# EAGLE design grids_v02 (EAGLE 7.7.0)
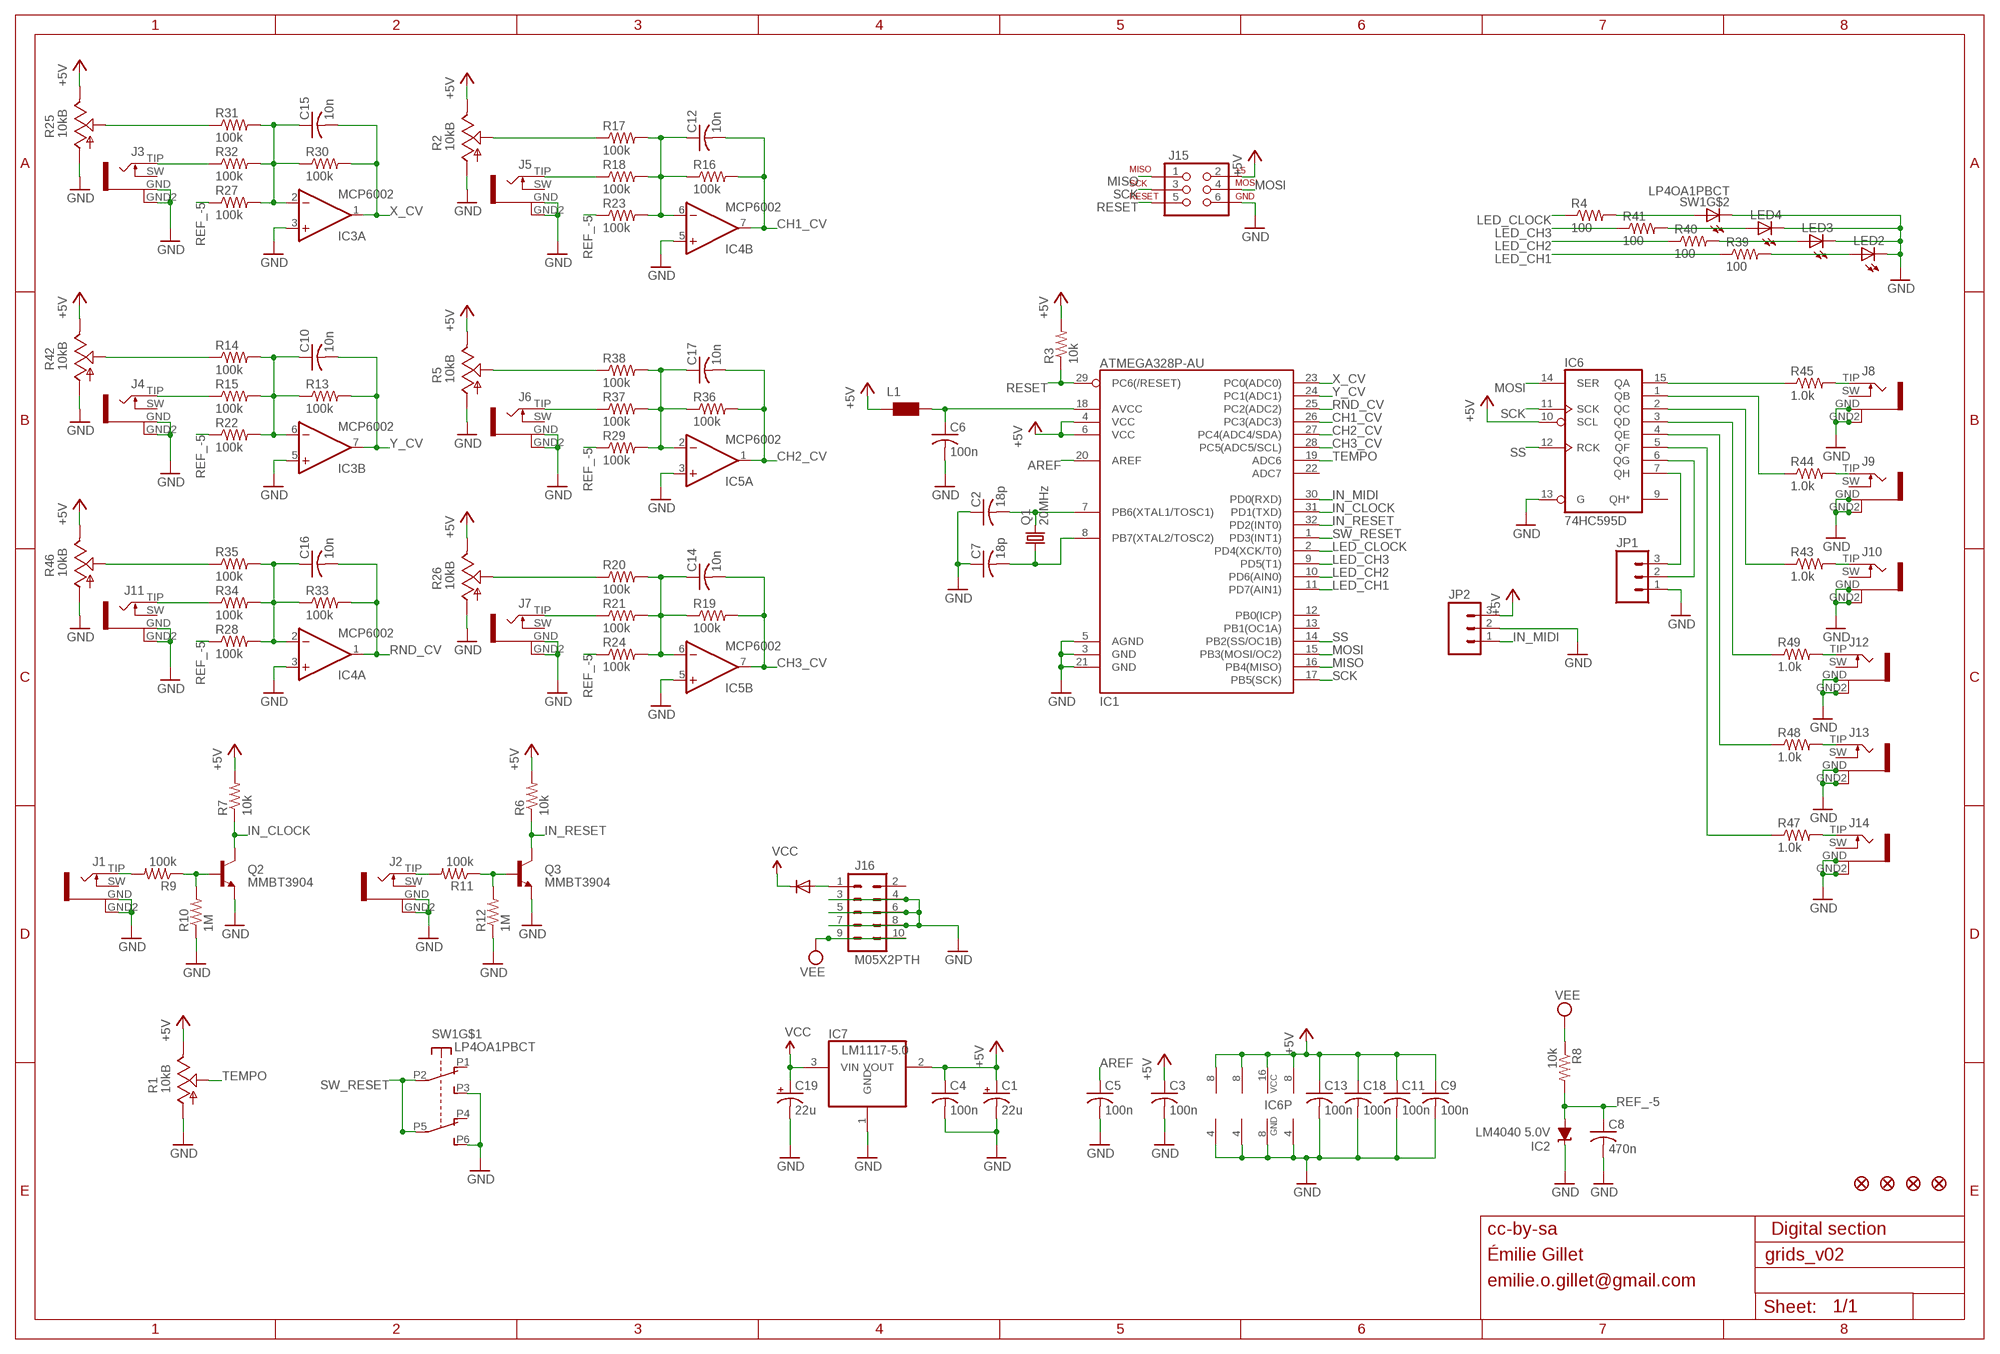
[diagram p0: schematic, sheet 1]

## Parts
C1  22u  CPOL-USC  [PANASONIC_C]
C2  18p  C-USC0603  [C0603]
C3  100n  C-USC0603  [C0603]
C4  100n  C-USC0603  [C0603]
C5  100n  C-USC0603  [C0603]
C6  100n  C-USC0603  [C0603]
C7  18p  C-USC0603  [C0603]
C8  470n  C-USC0603  [C0603]
C9  100n  C-USC0603  [C0603]
C10  10n  C-USC0603  [C0603]
C11  100n  C-USC0603  [C0603]
C12  10n  C-USC0603  [C0603]
C13  100n  C-USC0603  [C0603]
C14  10n  C-USC0603  [C0603]
C15  10n  C-USC0603  [C0603]
C16  10n  C-USC0603  [C0603]
C17  10n  C-USC0603  [C0603]
C18  100n  C-USC0603  [C0603]
C19  22u  CPOL-USC  [PANASONIC_C]
D1  1N5819HW  DIODE-SOD123  [SOD123]
F1  FIDUCIAL1X2  [FIDUCIAL-1X2]
F2  FIDUCIAL1X2  [FIDUCIAL-1X2]
F3  FIDUCIAL1X2  [FIDUCIAL-1X2]
F4  FIDUCIAL1X2  [FIDUCIAL-1X2]
IC1  ATMEGA328P-AU  ATMEGA168  [TQFP32-08]
IC2  LM4040 5.0V  LM4041C12DBZ  [DBZ_R-PDSO-G3]
IC3  MCP6002  TL072D  [SO08]
IC4  MCP6002  TL072D  [SO08]
IC5  MCP6002  TL072D  [SO08]
IC6  74HC595D  [SO16]
IC7  LM1117-5.0  REG1117  [SOT223]
J1  PJ301WQP  [WQP_PJ_301BM]
J2  PJ301WQP  [WQP_PJ_301BM]
J3  PJ301WQP  [WQP_PJ_301BM]
J4  PJ301WQP  [WQP_PJ_301BM]
J5  PJ301WQP  [WQP_PJ_301BM]
J6  PJ301WQP  [WQP_PJ_301BM]
J7  PJ301WQP  [WQP_PJ_301BM]
J8  PJ301WQP  [WQP_PJ_301BM]
J9  PJ301WQP  [WQP_PJ_301BM]
J10  PJ301WQP  [WQP_PJ_301BM]
J11  PJ301WQP  [WQP_PJ_301BM]
J12  PJ301WQP  [WQP_PJ_301BM]
J13  PJ301WQP  [WQP_PJ_301BM]
J14  PJ301WQP  [WQP_PJ_301BM]
J15  AVR_SPI_PRG_6PTH  [2X3]
J16  M05X2PTH  [AVR_ICSP]
JP1  M03PTH  [1X03]
JP2  M03PTH  [1X03]
L1  WE-CBF_0603  [0603]
LED2  LED3MM  [LED3MM]
LED3  LED3MM  [LED3MM]
LED4  LED3MM  [LED3MM]
Q1  20MHz  CRYSTALHC49UP  [HC49UP]
Q2  MMBT3904  MMBT3904LT1-NPN-SOT23-BEC  [SOT23-BEC]
Q3  MMBT3904  MMBT3904LT1-NPN-SOT23-BEC  [SOT23-BEC]
R1  10kB  POT_USVERTICAL_PS  [ALPS_POT_VERTICAL_PS]
R2  10kB  POT_USVERTICAL_PS  [ALPS_POT_VERTICAL_PS]
R3  10k  R-US_R0603  [R0603]
R4  100  R-US_R0603  [R0603]
R5  10kB  POT_USVERTICAL_PS  [ALPS_POT_VERTICAL_PS]
R6  10k  R-US_R0603  [R0603]
R7  10k  R-US_R0603  [R0603]
R8  10k  R-US_R0603  [R0603]
R9  100k  R-US_R0603  [R0603]
R10  1M  R-US_R0603  [R0603]
R11  100k  R-US_R0603  [R0603]
R12  1M  R-US_R0603  [R0603]
R13  100k  R-US_R0603  [R0603]
R14  100k  R-US_R0603  [R0603]
R15  100k  R-US_R0603  [R0603]
R16  100k  R-US_R0603  [R0603]
R17  100k  R-US_R0603  [R0603]
R18  100k  R-US_R0603  [R0603]
R19  100k  R-US_R0603  [R0603]
R20  100k  R-US_R0603  [R0603]
R21  100k  R-US_R0603  [R0603]
R22  100k  R-US_R0603  [R0603]
R23  100k  R-US_R0603  [R0603]
R24  100k  R-US_R0603  [R0603]
R25  10kB  POT_USVERTICAL_PS  [ALPS_POT_VERTICAL_PS]
R26  10kB  POT_USVERTICAL_PS  [ALPS_POT_VERTICAL_PS]
R27  100k  R-US_R0603  [R0603]
R28  100k  R-US_R0603  [R0603]
R29  100k  R-US_R0603  [R0603]
R30  100k  R-US_R0603  [R0603]
R31  100k  R-US_R0603  [R0603]
R32  100k  R-US_R0603  [R0603]
R33  100k  R-US_R0603  [R0603]
R34  100k  R-US_R0603  [R0603]
R35  100k  R-US_R0603  [R0603]
R36  100k  R-US_R0603  [R0603]
R37  100k  R-US_R0603  [R0603]
R38  100k  R-US_R0603  [R0603]
R39  100  R-US_R0603  [R0603]
R40  100  R-US_R0603  [R0603]
R41  100  R-US_R0603  [R0603]
R42  10kB  POT_USVERTICAL_PS4  [ALPS_POT_VERTICAL_PS4]
R43  1.0k  R-US_R0603  [R0603]
R44  1.0k  R-US_R0603  [R0603]
R45  1.0k  R-US_R0603  [R0603]
R46  10kB  POT_USVERTICAL_PS  [ALPS_POT_VERTICAL_PS]
R47  1.0k  R-US_R0603  [R0603]
R48  1.0k  R-US_R0603  [R0603]
R49  1.0k  R-US_R0603  [R0603]
SW1  LP4OA1PBCT  [LP4OA1PBCT]

## Nets
+5V: C1.+ C3.1 C4.1 C9.1 C11.1 C13.1 C18.1 IC1.4(VCC) IC1.6(VCC) IC3.8(P:V+) IC4.8(P:V+) IC5.8(P:V+) IC6.10(SCL) IC6.16(VCC) IC7.2(VOUT) J15.2 JP2.3 L1.1 R1.P$1(E) R2.P$1(E) R3.2 R5.P$1(E) R6.2 R7.2 R25.P$1(E) R26.P$1(E) R42.P$1(E) R46.P$1(E)
AREF: C5.1 IC1.20(AREF)
CH1_CV: C12.2 IC1.26(PC3(ADC3)) IC4.7(B:OUT) R16.2
CH2_CV: C17.2 IC1.27(PC4(ADC4/SDA)) IC5.1(A:OUT) R36.2
CH3_CV: C14.2 IC1.28(PC5(ADC5/SCL)) IC5.7(B:OUT) R19.2
CLOCK_OUT: IC6.6(QG) JP1.2
GATE1_IN: J1.TIP R9.2
GATE1_LED: R4.2 SW1.L1
GATE2_IN: J2.TIP R11.2
GATE2_LED: LED4.A R41.2
GATE3_LED: LED3.A R40.2
GATE4_LED: LED2.A R39.2
GND: C1.- C2.1 C3.2 C4.2 C5.2 C6.2 C7.1 C8.2 C9.2 C11.2 C13.2 C18.2 C19.- IC1.3(GND) IC1.5(AGND) IC1.21(GND) IC2.1(C) IC3.3(A:+IN) IC3.4(P:V-) IC3.5(B:+IN) IC4.3(A:+IN) IC4.4(P:V-) IC4.5(B:+IN) IC5.3(A:+IN) IC5.4(P:V-) IC5.5(B:+IN) IC6.8(GND) IC6.13(G) IC7.1(GND) J1.GND J1.GND2 J2.GND J2.GND2 J3.GND J3.GND2 J4.GND J4.GND2 J5.GND J5.GND2 J6.GND J6.GND2 J7.GND J7.GND2 J8.GND J8.GND2 J9.GND J9.GND2 J10.GND J10.GND2 J11.GND J11.GND2 J12.GND J12.GND2 J13.GND J13.GND2 J14.GND J14.GND2 J15.6 J16.3 J16.4 J16.5 J16.6 J16.7 J16.8 JP1.1 JP2.2 LED2.K(C) LED3.K(C) LED4.K(C) Q2.E Q3.E R1.P$3(A) R2.P$3(A) R5.P$3(A) R10.1 R12.1 R25.P$3(A) R26.P$3(A) R42.P$3(A) R46.P$3(A) SW1.L2 SW1.P3(A3) SW1.P6(B3)
IN_CLOCK: IC1.31(PD1(TXD)) Q2.C R7.1
IN_MIDI: IC1.30(PD0(RXD)) JP2.1
IN_RESET: IC1.32(PD2(INT0)) Q3.C R6.1
LED_CH1: IC1.11(PD7(AIN1)) R39.1
LED_CH2: IC1.10(PD6(AIN0)) R40.1
LED_CH3: IC1.9(PD5(T1)) R41.1
LED_CLOCK: IC1.2(PD4(XCK/T0)) R4.1
MISO: IC1.16(PB4(MISO)) J15.1
MOSI: IC1.15(PB3(MOSI/OC2)) IC6.14(SER) J15.4
N$1: Q2.B R9.1 R10.2
N$2: Q3.B R11.1 R12.2
N$3: D1.A J16.1
N$4: J14.TIP R47.2
N$5: J13.TIP R48.2
N$6: J12.TIP R49.2
N$9: R25.P$2(S) R31.1
N$10: J3.TIP R32.1
N$12: C10.1 IC3.6(B:-IN) R13.1 R14.2 R15.2 R22.2
N$13: R14.1 R42.P$2(S)
N$14: J4.TIP R15.1
N$15: C16.1 IC4.2(A:-IN) R28.2 R33.1 R34.2 R35.2
N$16: R35.1 R46.P$2(S)
N$17: J11.TIP R34.1
N$18: C12.1 IC4.6(B:-IN) R16.1 R17.2 R18.2 R23.2
N$19: R2.P$2(S) R17.1
N$20: J5.TIP R18.1
N$21: C17.1 IC5.2(A:-IN) R29.2 R36.1 R37.2 R38.2
N$22: R5.P$2(S) R38.1
N$23: J6.TIP R37.1
N$24: C14.1 IC5.6(B:-IN) R19.1 R20.2 R21.2 R24.2
N$25: R20.1 R26.P$2(S)
N$26: J7.TIP R21.1
N$27: IC6.15(QA) R45.1
N$28: IC6.1(QB) R44.1
N$29: C15.1 IC3.2(A:-IN) R27.2 R30.1 R31.2 R32.2
N$30: IC6.2(QC) R43.1
N$31: IC6.3(QD) R49.1
N$32: IC6.4(QE) R48.1
N$33: IC6.5(QF) R47.1
N$34: J8.TIP R45.2
N$35: J9.TIP R44.2
N$36: J10.TIP R43.2
N$39: C6.1 IC1.18(AVCC) L1.2
N$82: C7.2 IC1.8(PB7(XTAL2/TOSC2)) Q1.1
N$83: C2.2 IC1.7(PB6(XTAL1/TOSC1)) Q1.2
RANDOM_GATE: IC6.7(QH) JP1.3
REF_-5: C8.1 IC2.2(A) R8.2 R22.1 R23.1 R24.1 R27.1 R28.1 R29.1
RESET: IC1.29(PC6(/RESET)) J15.5 R3.1
RND_CV: C16.2 IC1.25(PC2(ADC2)) IC4.1(A:OUT) R33.2
SCK: IC1.17(PB5(SCK)) IC6.11(SCK) J15.3
SS: IC1.14(PB2(SS/OC1B)) IC6.12(RCK)
SW_RESET: IC1.1(PD3(INT1)) SW1.P2(A2) SW1.P5(B2)
TEMPO: IC1.19(ADC6) R1.P$2(S)
VCC: C19.+ D1.C IC7.3(VIN)
VEE: J16.9 J16.10 R8.1
X_CV: C15.2 IC1.23(PC0(ADC0)) IC3.1(A:OUT) R30.2
Y_CV: C10.2 IC1.24(PC1(ADC1)) IC3.7(B:OUT) R13.2
Unconnected: IC1.12(PB0(ICP)) IC1.13(PB1(OC1A)) IC1.22(ADC7) IC6.9(QH*) J1.SW J2.SW J3.SW J4.SW J5.SW J6.SW J7.SW J8.SW J9.SW J10.SW J11.SW J12.SW J13.SW J14.SW J16.2 SW1.P1(A1) SW1.P4(B1)

## Notes on the sheet
- cc-by-sa | Digital section
- Émilie Gillet
- emilie.o.gillet@gmail.com

## Library data of the parts
C1 C19 = rcl:CPOL-US: POLARIZED CAPACITOR, American symbol
C2-C18 = rcl:C-US: CAPACITOR, American symbol
D1 = diode:DIODE-: DIODE
F1-F4 = SparkFun:FIDUCIAL: Fiducial Alignment Points Various fiducial points for machine vision alignment.
IC1 = SparkFun:ATMEGA168
IC2 = texas:LM4041: PRECISION MICROPOWER SHUNT VOLTAGE REFERENCE Source: http://focus.ti.com/lit/ds/slcs146e/slcs146e.pdf
IC3-IC5 = og-linear:TL072: OP AMP
IC6 = 74xx-eu:74*595: 8-bit SHIFT REGISTER, output latch
IC7 = og-vreg:REG1117: 800mA and 1A Low Dropout (LDO) Positive Regulator 1.8V, 2.5V, 2.85V, 3.3V, 5V, and Adj
J1-J14 = og-pj301:PJ301
J15 = SparkFun:AVR_SPI_PRG_6: AVR ISP 6 Pin This is the reduced ISP connector for AVR programming. Common on Arduino. This footprint will take up less PCB space and can be used with a 10-pin to 6-pin adapter such as SKU: BOB-08508
J16 = og-header:M05X2: Header 5x2 Standard 10-pin dual row 0.1" header. Commonly used with AVR-ISP. Use with Spark Fun Electronics SKU: PRT-00778
JP1 JP2 = SparkFun:M03: Header 3 Standard 3-pin 0.1" header. Use with straight break away headers (SKU : PRT-00116), right angle break away headers (PRT-00553), swiss pins (PRT-00743), machine pins (PRT-00117), and female headers (PRT-00115). Molex polarized connector foot print use with SKU : PRT-08232 with associated crimp pins and housings.
L1 = wuerth-elektronik:WE-CBF: SMD EMI Suppression Ferrite Beads - excellent anti-EMI properties - low DCR - impedances till 3000 ohms - rated current up to 6 A
LED2-LED4 = led:LED: LED OSRAM: - CHIPLED LG R971, LG N971, LY N971, LG Q971, LY Q971, LO R971, LY R971 LH N974, LH R974 LS Q976, LO Q976, LY Q976 LO Q996 - Hyper CHIPLED LW Q18S LB Q993, LB Q99A, LB R99A - SideLED LS A670, LO A670, LY A670, LG A670, LP A670 LB A673, LV A673, LT A673, LW A673 LH A674 LY A675 LS A676, LA A676, LO A676, LY A676, LW A676 LS A679, LY A679, LG A679 - Hyper Micro SIDELED® LS Y876, LA Y876, LO Y876, LY Y876 LT Y87S - SmartLED LW L88C, LW L88S LB L89C, LB L89S, LG L890 LS L89K, LO L89K, LY L89K LS L896, LA L896, LO L896, LY L896 - TOPLED LS T670, LO T670, LY T670, LG T670, LP T670 LSG T670, LSP T670, LSY T670, LOP T670, LYG T670 LG T671, LOG T671, LSG T671 LB T673, LV T673, LT T673, LW T673 LH T674 LS T676, LA T676, LO T676, LY T676, LB T676, LH T676, LSB T676, LW T676 LB T67C, LV T67C, LT T67C, LS T67K, LO T67K, LY T67K, LW E67C LS E67B, LA E67B, LO E67B, LY E67B, LB E67C, LV E67C, LT E67C LW T67C LS T679, LY T679, LG T679 LS T770, LO T770, LY T770, LG T770, LP T770 LB T773, LV T773, LT T773, LW T773 LH T774 LS E675, LA E675, LY E675, LS T675 LS T776, LA T776, LO T776, LY T776, LB T776 LHGB T686 LT T68C, LB T68C - Hyper Mini TOPLED® LB M676 - Mini TOPLED Santana® LG M470 LS M47K, LO M47K, LY M47K Source: http://www.osram.convergy.de LUXEON: - LUMILED® LXK2-PW12-R00, LXK2-PW12-S00, LXK2-PW14-U00, LXK2-PW14-V00 LXK2-PM12-R00, LXK2-PM12-S00, LXK2-PM14-U00 LXK2-PE12-Q00, LXK2-PE12-R00, LXK2-PE12-S00, LXK2-PE14-T00, LXK2-PE14-U00 LXK2-PB12-K00, LXK2-PB12-L00, LXK2-PB12-M00, LXK2-PB14-N00, LXK2-PB14-P00, LXK2-PB14-Q00 LXK2-PR12-L00, LXK2-PR12-M00, LXK2-PR14-Q00, LXK2-PR14-R00 LXK2-PD12-Q00, LXK2-PD12-R00, LXK2-PD12-S00 LXK2-PH12-R00, LXK2-PH12-S00 LXK2-PL12-P00, LXK2-PL12-Q00, LXK2-PL12-R00 Source: www.luxeon.com KINGBRIGHT: KA-3528ASYC Source: www.kingbright.com
Q1 = crystal:CRYSTAL: CRYSTAL
Q2 Q3 = transistor:*-NPN-: NPN Transistror BF959 corrected 2008.03.06
R1 R2 R5 R25 R26 R42 R46 = pot-alps:POT_US
R3 R4 R6 R7 R9-R24 R27-R41 R43-R45 R47-R49 = rcl:R-US_: RESISTOR, American symbol
R8 = resistor:R-US_: RESISTOR, American symbol
SW1 = og-switch:LP4OA1PBCT

## Board
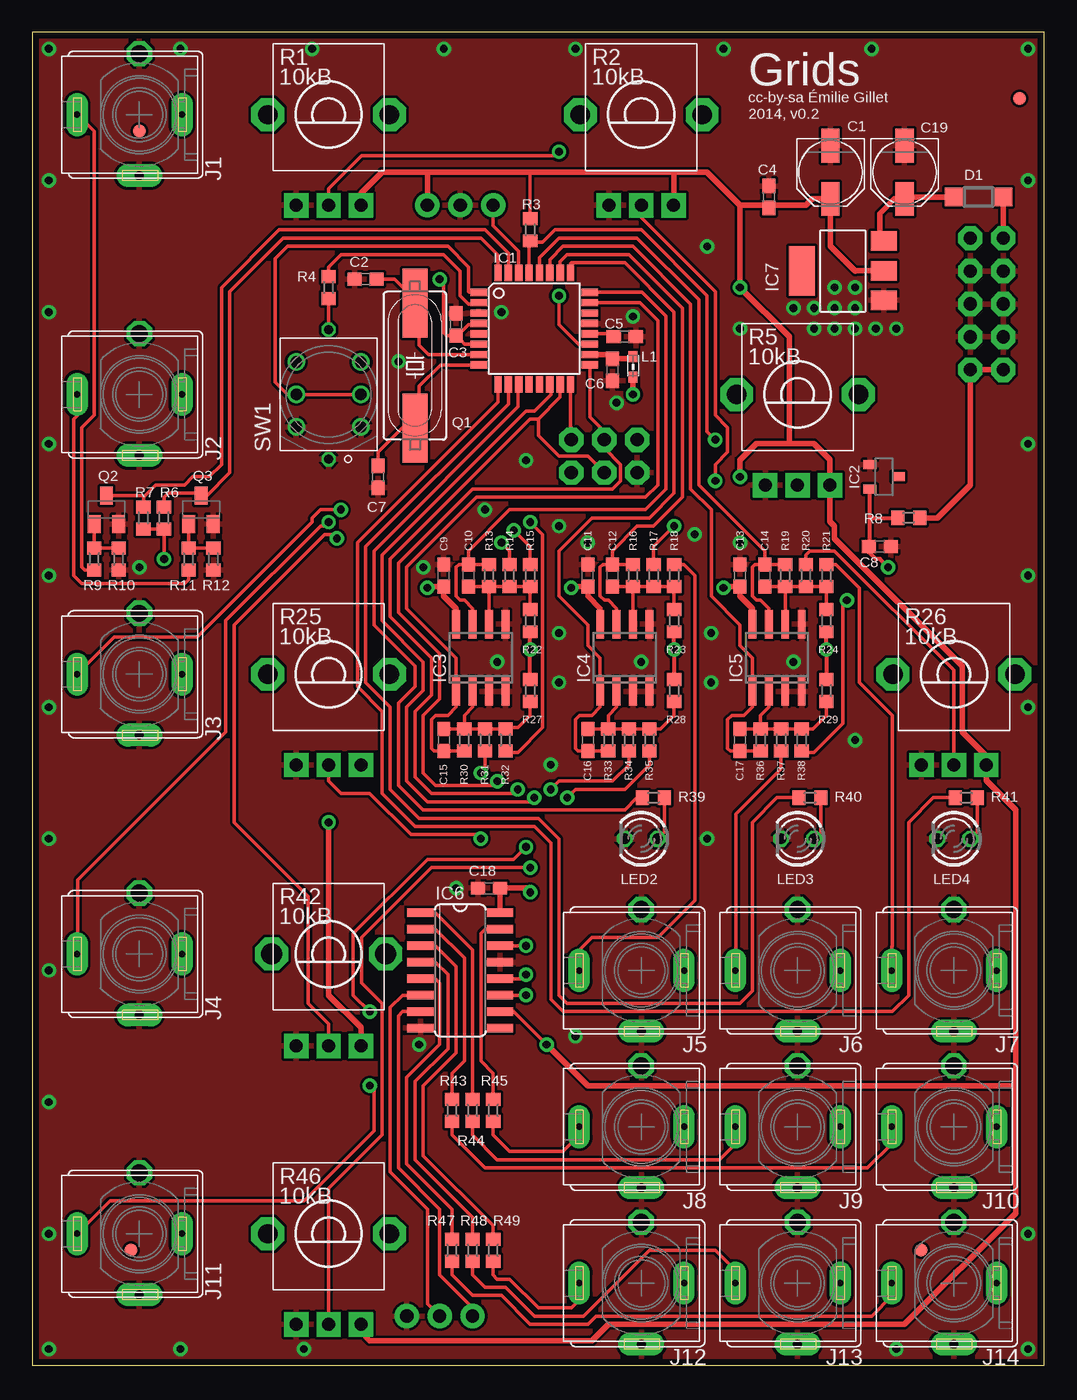
[diagram p1: board, top side]
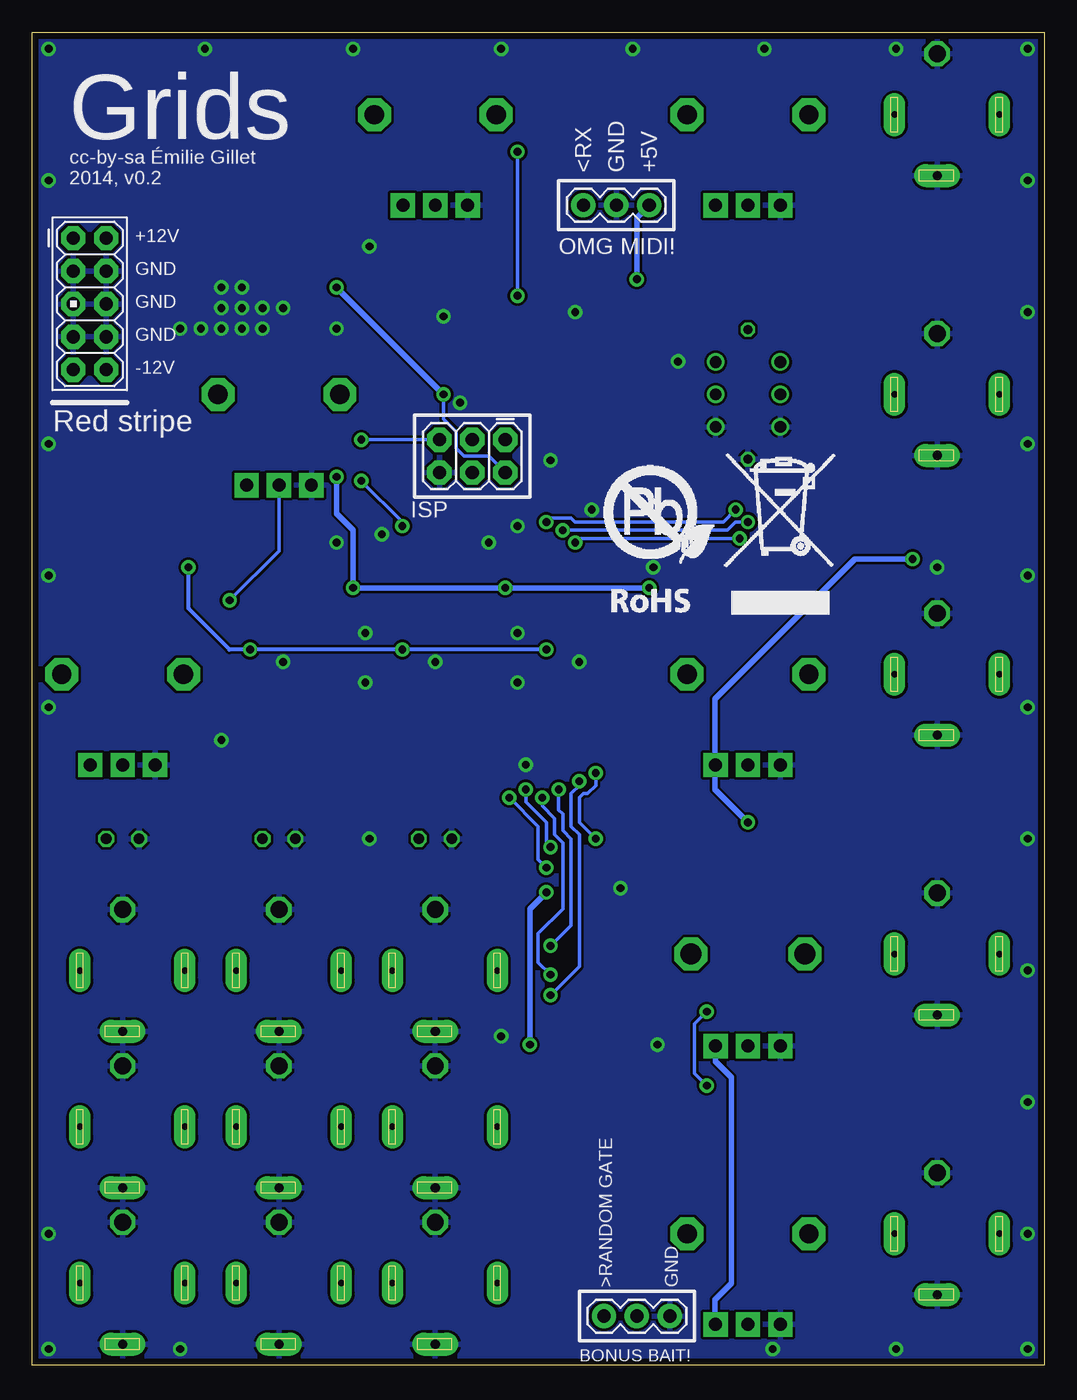
[diagram p2: board, bottom side, seen from below]

Size 78.08 x 102.87 mm. Coordinates in mm from the lower left corner, seen from the top.
Outline: 0,0 78.08,0 78.08,102.87 0,102.87 0,0
Copper layers (1*16): Top 0.035mm / dielectric 1.5mm / Bottom 0.035mm
Design rules "PCBCart-Standard *": minimum track width 8mil, minimum drill 0.4mm, track to track 8mil, track to pad 8mil, pad to pad 8mil, via to via 8mil, smd to smd 8mil, copper to edge 20mil, drill to drill 8mil, minimum pad ring 8mil, minimum via ring 10mil, stop-mask expansion 3mil, vias tented up to drill 25mil, thermal gap 8mil

### Footprints (pad centres in the part's own frame; a part is rotated, then mirrored left to right if it is on the bottom)
PANASONIC_C = smd 2.6 x 1.4: + 2.05,0; - -2.05,0
C0603 = smd 1.1 x 1: 1 -0.85,0; 2 0.85,0
SOD123 = smd 1.4 x 1.4: A 1.9,0; C -1.9,0
FIDUCIAL-1X2 = smd 1 x 1: 1 0,0
TQFP32-08 = smd 1.27 x 0.559: 1 -4.293,2.8; 2 -4.293,2; 3 -4.293,1.2; 4 -4.293,0.4; 5 -4.293,-0.4; 6 -4.293,-1.2; 7 -4.293,-2; 8 -4.293,-2.8; 17 4.293,-2.8; 18 4.293,-2; 19 4.293,-1.2; 20 4.293,-0.4; 21 4.293,0.4; 22 4.293,1.2; 23 4.293,2; 24 4.293,2.8 | smd 0.559 x 1.27: 9 -2.8,-4.293; 10 -2,-4.293; 11 -1.2,-4.293; 12 -0.4,-4.293; 13 0.4,-4.293; 14 1.2,-4.293; 15 2,-4.293; 16 2.8,-4.293; 25 2.8,4.293; 26 2,4.293; 27 1.2,4.293; 28 0.4,4.293; 29 -0.4,4.293; 30 -1.2,4.293; 31 -2,4.293; 32 -2.8,4.293
DBZ_R-PDSO-G3 = smd 0.7 x 1: 1 -0.95,-1.1; 2 0.95,-1.1; 3 0,1.1
SO08 = smd 0.6 x 2.2: 1 -1.905,-2.6; 2 -0.635,-2.6; 3 0.635,-2.6; 4 1.905,-2.6; 5 1.905,2.6; 6 0.635,2.6; 7 -0.635,2.6; 8 -1.905,2.6
SO16 = smd 0.66 x 2.032: 1 -4.445,-3.073; 2 -3.175,-3.073; 3 -1.905,-3.073; 4 -0.635,-3.073; 5 0.635,-3.073; 6 1.905,-3.073; 7 3.175,-3.073; 8 4.445,-3.073; 9 4.445,3.073; 10 3.175,3.073; 11 1.905,3.073; 12 0.635,3.073; 13 -0.635,3.073; 14 -1.905,3.073; 15 -3.175,3.073; 16 -4.445,3.073
SOT223 = smd 1.499 x 2.007: 1 -2.261,-3.15; 2 0.025,-3.15; 3 2.311,-3.15 | smd 3.81 x 2.007: 4 0,3.15
WQP_PJ_301BM = drill 0.7 pad 1.778 long: GND -4.7,0 | drill 1.3 octagon: GND2 4.7,0 | drill 0.5 pad 1.676 long: SW 0,-3.3; TIP 0,4.8
2X3 = drill 1.016 pad 1.88 octagon: 1 0,0; 2 0,2.54; 3 2.54,0; 4 2.54,2.54; 5 5.08,0; 6 5.08,2.54
AVR_ICSP = drill 1.016 pad 1.88 octagon: 1 -1.27,5.08; 2 1.27,5.08; 3 -1.27,2.54; 4 1.27,2.54; 5 -1.27,0; 6 1.27,0; 7 -1.27,-2.54; 8 1.27,-2.54; 9 -1.27,-5.08; 10 1.27,-5.08
1X03 = drill 1.016 pad 1.88 round: 1 0,0; 2 2.54,0; 3 5.08,0
0603 = smd 0.85 x 0.7: 1 -0.9,0; 2 0.7,0
LED3MM = drill 0.813 octagon: A -1.27,0; K 1.27,0
HC49UP = smd 5.334 x 1.93: 1 -4.826,0; 2 4.826,0
SOT23-BEC = smd 1 x 1.4: B -0.95,-1.1; C 0,1.1; E 0.95,-1.1
ALPS_POT_VERTICAL_PS = drill 1 pad 1.88 square: P$1 -2.5,7; P$2 0,7; P$3 2.5,7 | drill 1.5 pad 2.54 octagon: P$4 -4.7,0; P$5 4.7,0
R0603 = smd 1 x 1.1: 1 -0.85,0; 2 0.85,0
ALPS_POT_VERTICAL_PS4 = drill 1 pad 1.88 square: P$1 -2.5,7.1; P$2 0,7.1; P$3 2.5,7.1 | drill 1.6 pad 2.54 octagon: P$4 -4.4,0; P$5 4.4,0
LP4OA1PBCT = drill 0.7 octagon: L1 5,0; L2 -5,0 | drill 0.9 round: P1 2.5,2.5; P2 0,2.5; P3 -2.5,2.5; P4 2.5,-2.5; P5 0,-2.5; P6 -2.5,-2.5

### Placement (x,y rotation side)
C1  61.59,92.08 270 top
C2  25.72,83.82 0 top
C3  32.7,80.33 90 top
C4  56.83,90.17 90 top
C5  45.72,79.38 0 top
C6  44.77,76.83 270 top
C7  26.67,68.58 90 top
C8  65.41,63.18 0 top
C9  31.75,60.96 90 top
C10  33.66,60.96 90 top
C11  42.86,60.96 90 top
C12  44.77,60.96 90 top
C13  54.61,60.96 90 top
C14  56.52,60.96 90 top
C15  31.75,48.26 270 top
C16  42.86,48.26 270 top
C17  54.61,48.26 270 top
C18  35.24,36.83 180 top
C19  67.31,92.08 270 top
D1  73.03,90.17 0 top
F1  76.2,97.79 90 top
F2  8.26,95.25 90 top
F3  7.62,8.89 90 top
F4  68.58,8.89 90 top
IC1  38.73,80.01 0 top
IC2  65.72,68.58 270 top
IC3  34.61,54.61 0 top
IC4  45.72,54.61 0 top
IC5  57.47,54.61 0 top
IC6  33.02,30.48 270 top
IC7  62.55,84.45 90 top
J1  8.26,96.52 90 top
J2  8.26,74.93 90 top
J3  8.26,53.34 90 top
J4  8.26,31.75 90 top
J5  46.99,30.48 90 top
J6  59.05,30.48 90 top
J7  71.12,30.48 90 top
J8  46.99,18.41 90 top
J9  59.05,18.41 90 top
J10  71.12,18.41 90 top
J11  8.26,10.16 90 top
J12  46.99,6.35 90 top
J13  59.05,6.35 90 top
J14  71.12,6.35 90 top
J15  41.59,71.44 180 bottom
J16  73.66,81.92 0 bottom
JP1  28.89,3.81 180 bottom
JP2  35.56,89.53 0 bottom
L1  46.35,77.15 90 top
LED2  46.99,40.64 180 top
LED3  59.05,40.64 180 top
LED4  71.12,40.64 180 top
Q1  29.53,77.15 90 top
Q2  5.71,66.04 0 top
Q3  13.02,66.04 0 top
R1  22.86,96.52 180 top
R2  46.99,96.52 180 top
R3  38.42,87.63 90 top
R4  22.86,83.19 270 top
R5  59.05,74.93 180 top
R6  10.16,65.41 270 top
R7  8.57,65.41 270 top
R8  67.63,65.41 180 top
R9  4.76,62.23 270 top
R10  6.67,62.23 90 top
R11  12.06,62.23 270 top
R12  13.97,62.23 90 top
R13  35.24,60.96 90 top
R14  36.83,60.96 270 top
R15  38.42,60.96 270 top
R16  46.35,60.96 90 top
R17  47.94,60.96 270 top
R18  49.53,60.96 270 top
R19  58.1,60.96 90 top
R20  59.69,60.96 270 top
R21  61.28,60.96 270 top
R22  38.42,57.47 90 top
R23  49.53,57.47 90 top
R24  61.28,57.47 90 top
R25  22.86,53.34 180 top
R26  71.12,53.34 180 top
R27  38.42,52.07 270 top
R28  49.53,52.07 270 top
R29  61.28,52.07 270 top
R30  33.34,48.26 270 top
R31  34.92,48.26 90 top
R32  36.51,48.26 90 top
R33  44.45,48.26 270 top
R34  46.04,48.26 90 top
R35  47.62,48.26 90 top
R36  56.2,48.26 270 top
R37  57.78,48.26 90 top
R38  59.37,48.26 90 top
R39  47.94,43.81 0 top
R40  60.01,43.81 0 top
R41  72.07,43.81 0 top
R42  22.86,31.75 180 top
R43  32.38,19.68 270 top
R44  33.97,19.68 270 top
R45  35.56,19.68 270 top
R46  22.86,10.16 180 top
R47  32.38,8.89 270 top
R48  33.97,8.89 270 top
R49  35.56,8.89 270 top
SW1  22.86,74.93 90 top
U$1  [EURORACK_TEMPLATE]  -0.64,117.47 0 top  (outside the outline)
U$2  [ROHS_BIG]  35.24,57.15 0 bottom

### Tracks (layer width: path | path; a pad name or v marks a point on that pad's centre or on a via)
+5V  (via drill 0.6)
  Top 0.254: v39.69,24.77 37.15,27.3 IC6.10 | 38.42,92.08 R3.2 | 34.51,78.74 IC1.6 33.37,78.81 33.07,79.11 | v10.16,62.23 R6.2 R7.2 | v31.43,83.82 31.75,83.5 31.75,79.69 31.96,79.48 C3.1 33.07,79.11 | IC1.4 34.36,80.33 33.66,80.33 33.07,79.74 33.07,79.11
  Top 0.406: 30.48,92.08 26.99,92.08 25.36,90.45 R1.P$1 | 30.48,92.08 38.42,92.08 49.53,92.08 | v39.69,24.77 42.86,21.59 75.88,21.59 | IC3.8 32.66,57.25 32.7,57.3 32.7,58.42 31.75,59.37 C9.1 30.58,60.11 v30.48,60.01 | IC4.8 43.77,57.25 43.81,57.3 43.81,58.42 42.86,59.37 C11.1 41.7,60.11 v41.59,60.01 | v46.35,74.93 L1.1 | IC5.8 55.56,58.42 54.61,59.37 C13.1 | C13.1 54.51,60.01 | v38.42,36.51 38.1,36.83 C18.1 IC6.16 | v22.86,41.91 22.86,28.57 25.36,26.07 R42.P$1 | 75.88,21.59 75.88,42.86 73.62,45.12 R26.P$1 73.66,46.38 73.66,46.99 71.75,48.9 71.75,53.98 61.91,63.82 61.91,64.77 61.55,65.13 R5.P$1 61.55,69.89 60.33,71.12 58.42,71.12 | R46.P$1 25.36,2.58 26.04,1.91 43.18,1.91 44.45,3.17 67.31,3.17 75.88,11.75 75.88,21.59 | v53.34,60.01 53.44,60.11 C13.1 | v54.61,68.58 54.61,69.85 55.88,71.12 58.42,71.12 | 30.48,92.08 JP2.3 | R2.P$1 49.53,89.56 49.53,92.08 | 58.42,71.12 58.42,79.38 v54.61,83.19 54.61,89.53 | IC7.2 63.5,84.48 63.5,84.45 61.59,86.36 C1.+ 60.18,90.03 59.69,89.53 57.05,89.53 C4.1 56.62,89.53 54.61,89.53 | 49.53,92.08 52.07,92.08 54.61,89.53
  Bottom 0.254: J15.2 42.86,70.17 44.77,70.17 45.4,70.8 45.4,72.07 46.35,73.03 v46.35,74.93
  Bottom 0.406: v39.69,24.77 39.69,35.24 v38.42,36.51 | v30.48,60.01 v41.59,60.01 v53.34,60.01 53.34,64.45 54.61,65.72 v54.61,68.58 | v54.61,83.19 v46.35,74.93 | JP2.3 31.43,88.58 v31.43,83.82 | v22.86,41.91 25.4,44.45 25.4,46.3 R25.P$1 25.36,46.64 25.4,46.68 25.4,51.44 14.61,62.23 v10.16,62.23 | R46.P$1 25.4,3.2 25.4,5.08 24.13,6.35 24.13,22.23 25.36,23.45 R42.P$1
AREF
  Top 0.254: C5.1 44.63,79.61 IC1.20
CH1_CV
  Top 0.254: IC4.7 45.09,58.42 44.45,59.05 44.13,59.05 43.81,59.37 43.81,61.59 44.03,61.81 C12.2 | C12.2 R16.2 | C12.2 44.77,62.87 46.67,64.77 47.94,64.77 50.16,66.99 50.16,81.6 46.04,85.72 41.27,85.72 40.73,85.19 IC1.26
CH2_CV
  Top 0.254: IC1.27 39.94,85.34 40.96,86.36 46.35,86.36 50.8,81.92 50.8,67.63 52.39,66.04 52.39,59.37 54.61,57.15 54.61,55.56 55.56,54.61 IC5.1 55.56,50.8 54.93,50.16 53.98,50.16 53.66,49.85 53.66,47.62 53.87,47.41 C17.2 R36.2
CH3_CV
  Top 0.254: C14.2 56.52,62.87 51.44,67.94 51.44,82.23 46.67,87 40.64,87 39.13,85.49 IC1.28 | IC5.7 56.83,58.42 56.2,59.05 55.88,59.05 55.56,59.37 55.56,61.59 55.78,61.81 C14.2 | C14.2 R19.2
CLOCK_OUT
  Top 0.254: IC6.6 28.57,28.57 27.62,27.62 27.62,14.92 30.48,12.06 30.48,4.76 JP1.2
GATE1_IN
  Top 0.254: R9.2 4.03,61.38 3.81,61.59 3.81,72.39 4.76,73.34 4.76,95.25 3.49,96.52 J1.TIP
GATE1_LED
  Top 0.254: SW1.L1 R4.2
GATE2_IN
  Top 0.254: J2.TIP 3.49,74.89 3.49,73.34 3.17,73.03 3.17,60.96 3.81,60.33 11.75,60.33 12.06,60.64 R11.2
GATE2_LED
  Top 0.254: LED4.A 72.92,41.17 R41.2
GATE3_LED
  Top 0.254: LED3.A 60.86,41.17 R40.2
GATE4_LED
  Top 0.254: LED2.A 48.79,41.17 R39.2
GND  (via drill 0.6)
  other vias: 8.26,61.59 46.35,80.96 46.99,54.29 58.74,54.29 42.86,63.5 54.61,63.5 35.88,54.29 30.16,61.59 45.09,74.3 36.2,81.28 40.01,46.35 40.64,52.7 32.7,36.83 29.84,24.77 28.26,77.47 52.07,86.36 54.61,80.01 38.1,69.85 52.39,52.7 40.64,56.52 52.39,56.52 41.91,25.4 34.92,66.04 40.64,64.77 51.12,64.14 1.27,20.32 11.43,1.27 1.27,30.48 1.27,81.28 1.27,91.44 20.95,1.27 1.27,101.6 1.27,1.27 63.5,48.26 76.83,101.6 76.83,91.44 76.83,71.12 76.83,60.96 76.83,50.8 76.83,1.27 66.67,1.27 76.83,10.16 52.07,40.64 1.27,60.96 1.27,50.8 1.27,71.12 1.27,40.64 1.27,10.16 11.43,101.6 21.59,101.6 31.75,101.6 41.91,101.6 53.34,101.6 64.77,101.6 63.5,83.19 63.5,81.6 61.91,83.19 61.91,81.6 63.5,80.01 65.09,80.01 61.91,80.01 66.67,80.01 60.33,80.01 60.33,81.6 58.74,81.6
  pour Bottom: 0,102.87 0,0 78.11,0 78.11,102.87
  pour Top: 0,102.87 0,0 78.11,0 78.11,102.87
IN_CLOCK
  Top 0.254: 8.57,66.99 9.53,67.94 11.75,67.94 12.38,68.58 13.65,68.58 14.61,69.53 14.61,83.19 19.05,87.63 34.92,87.63 36.73,85.82 IC1.31 | 8.57,66.99 R7.1 | 8.57,66.99 8.43,67.14 Q2.C
IN_MIDI
  Top 0.254: JP2.1 35.56,87.95 37.53,85.97 IC1.30
IN_RESET
  Top 0.254: IC1.32 35.94,85.67 34.61,87 19.37,87 15.24,82.87 15.24,68.9 13.48,67.14 Q3.C 12.85,67.31 10.48,67.31 10.16,66.99 R6.1
LED_CH1
  Top 0.254: IC1.11 37.47,75.65 37.47,73.98 26.35,62.87 26.35,57.15 29.53,53.98 29.53,52.39 28.26,51.12 28.26,44.77 30.16,42.86 45.72,42.86 46.67,43.81 R39.1
LED_CH2
  Top 0.254: 36.83,75.62 IC1.10 36.73,74.2 25.72,63.18 25.72,52.7 27.62,50.8 27.62,44.45 29.84,42.23 39.05,42.23 40.64,40.64 40.64,28.57 41.27,27.94 54.61,27.94 55.56,28.89 55.56,41.91 57.47,43.81 R40.1
LED_CH3
  Top 0.254: 35.88,75.66 IC1.9 35.94,74.35 25.08,63.5 25.08,52.39 26.99,50.48 26.99,44.13 29.53,41.59 38.73,41.59 40.01,40.32 40.01,28.26 40.96,27.3 66.36,27.3 67.63,28.57 67.63,41.91 69.53,43.81 R41.1
LED_CLOCK
  Top 0.254: IC1.2 34.35,81.92 33.66,81.92 33.02,82.55 33.02,84.45 31.75,85.72 23.81,85.72 22.86,84.77 R4.1
MISO
  Top 0.254: J15.1 41.59,72.39 41.53,72.45 IC1.16
MOSI  (via drill 0.6)
  Top 0.254: J15.4 42.86,70.17 40.64,70.17 39.05,71.75 39.05,73.03 | v37.47,44.45 37.15,44.13 30.8,44.13 29.53,45.4 29.53,50.48 30.8,51.75 30.8,54.61 27.62,57.78 27.62,62.23 38.42,73.03 39.05,73.03 | IC6.14 v38.1,32.38 | 39.05,73.03 40.73,74.71 IC1.15
  Bottom 0.254: v37.47,44.45 37.47,42.86 37.15,42.55 37.15,41.27 36.51,40.64 36.51,33.97 v38.1,32.38
N$1
  Top 0.254: R10.2 R9.1 Q2.B
N$2
  Top 0.254: R12.2 R11.1 Q3.B
N$3
  Top 0.406: J16.1 D1.A
N$4
  Top 0.254: J14.TIP 66.32,5.36 64.77,3.81 43.5,3.81 42.86,3.17 38.42,3.17 36.2,5.4 33.97,5.4 32.38,6.99 R47.2
N$5
  Top 0.254: J13.TIP 54.26,7.34 52.7,8.89 47.62,8.89 42.55,3.81 38.73,3.81 36.51,6.03 34.92,6.03 33.97,6.99 R48.2
N$6
  Top 0.254: J12.TIP 42.19,5.04 41.59,4.45 39.05,4.45 36.83,6.67 35.88,6.67 35.56,6.99 R49.2
N$9  (via drill 0.6)
  Top 0.254: v34.61,40.64 34.29,40.96 29.21,40.96 26.04,44.13 23.81,44.13 22.86,45.09 R25.P$2 | v34.61,45.72 34.92,46.04 R31.1
  Bottom 0.254: v34.61,40.64 35.88,41.91 35.88,43.81 35.56,44.13 35.24,44.13 34.61,44.77 v34.61,45.72
N$10  (via drill 0.6)
  Top 0.254: J3.TIP 6.31,56.2 12.7,56.2 21.59,65.09 21.59,65.41 22.23,66.04 v23.81,66.04 | R32.1 36.62,47.31 37.47,47.31 39.37,49.21 39.37,64.14 v38.42,65.09
  Bottom 0.254: v38.42,65.09 38.1,65.41 36.51,65.41 36.2,65.09 24.77,65.09 v23.81,66.04
N$12
  Top 0.254: R13.1 C10.1 | IC3.6 R13.1 | R13.1 R14.2 R15.2 R22.2
N$13  (via drill 0.6)
  Top 0.254: R42.P$2 22.86,26.35 21.27,27.94 21.27,36.2 15.56,41.91 15.56,57.15 22.54,64.14 23.18,64.14 v23.5,63.82 | v36.2,63.5 36.83,62.87 R14.1
  Bottom 0.254: v23.5,63.82 35.88,63.82 v36.2,63.5
N$14  (via drill 0.6)
  Top 0.254: J4.TIP 3.49,31.79 3.49,37.47 14.92,48.9 14.92,57.47 22.23,64.77 22.54,64.77 v22.86,65.09 | v37.15,64.45 38.42,63.18 R15.1
  Bottom 0.254: v37.15,64.45 24.45,64.45 23.81,65.09 v22.86,65.09
N$15
  Top 0.254: C16.1 R33.1 | IC4.2 45.09,50.8 44.45,50.16 R33.1 | R33.1 R34.2 R35.2 48.48,49.11 49.53,50.16 R28.2
N$16  (via drill 0.6)
  Top 0.254: R35.1 47.62,46.35 45.72,44.45 41.91,44.45 v41.27,43.81 | R46.P$2 22.86,13.65 26.99,17.78 26.99,27.94 25.4,29.53 25.4,33.02 30.8,38.42 v38.42,38.42
  Bottom 0.254: v38.42,38.42 39.05,39.05 39.05,41.59 v41.27,43.81
N$17  (via drill 0.6)
  Top 0.254: R34.1 46.04,46.35 44.77,45.09 40.64,45.09 v40.01,44.45 | J11.TIP 6,12.7 20.95,12.7 26.35,18.1 26.35,21.27 v26.04,21.59 | v38.1,40.01 37.15,39.05 30.48,39.05 24.77,33.34 24.77,28.57 v26.04,27.3
  Bottom 0.254: v38.1,40.01 38.42,40.32 38.42,41.91 40.01,43.5 v40.01,44.45 | v26.04,27.3 26.99,26.35 26.99,22.54 v26.04,21.59
N$18
  Top 0.254: R16.1 IC4.6 | C12.1 R16.1 | R16.1 R17.2 R18.2 R23.2
N$19  (via drill 0.6)
  Top 0.254: R2.P$2 46.99,88.58 52.7,82.87 52.7,73.34 53.66,72.39 53.66,70.48 52.7,69.53 v52.7,68.26 | v49.53,64.77 47.94,63.18 R17.1
  Bottom 0.254: v49.53,64.77 49.53,65.09 v52.7,68.26
N$20
  Top 0.254: J5.TIP 42.19,32.03 43.18,33.02 48.26,33.02 51.12,35.88 51.12,60.96 50.27,61.81 R18.1
N$21
  Top 0.254: IC5.2 56.83,50.8 56.2,50.16 R36.1 | C17.1 R36.1 | R36.1 56.3,49.21 56.52,49.21 56.62,49.11 R37.2 R38.2 60.22,49.11 61.28,50.16 R29.2
N$22  (via drill 0.6)
  Top 0.254: R38.1 59.48,47.31 60.33,47.31 62.55,49.53 62.55,58.74 v62.87,59.05
  Bottom 0.254: v62.87,59.05 59.05,62.87 R5.P$2
N$23
  Top 0.254: R37.1 57.78,46.04 54.29,42.55 54.29,31.75 54.26,31.71 J6.TIP
N$24
  Top 0.254: IC5.6 R19.1 | R19.1 C14.1 | R19.1 R20.2 R21.2 R24.2
N$25
  Top 0.254: R20.1 59.69,62.55 60.01,62.87 61.91,62.87 71.12,53.66 R26.P$2
N$26
  Top 0.254: J7.TIP 66.32,32.35 66.36,32.38 66.36,50.16 63.82,52.7 63.82,60.01 62.02,61.81 R21.1
N$27
  Top 0.254: R45.1 35.56,22.54 34.61,23.5 34.61,33.34 34.92,33.66 IC6.15
N$28
  Top 0.254: R44.1 33.97,32.07 31.11,34.92 IC6.1
N$29
  Top 0.254: IC3.2 33.97,50.8 33.34,50.16 R30.1 | R30.1 R31.2 R32.2 36.62,49.21 37.47,49.21 38.42,50.16 R27.2 | C15.1 R30.1
N$30
  Top 0.254: R43.1 32.38,22.54 33.34,23.5 33.34,31.43 31.11,33.66 IC6.2
N$31
  Top 0.254: IC6.3 31.11,32.38 32.7,30.8 32.7,24.13 30.16,21.59 30.16,16.19 35.56,10.79 R49.1
N$32
  Top 0.254: IC6.4 31.11,31.11 32.07,30.16 32.07,24.45 29.53,21.91 29.53,15.88 33.97,11.43 R48.1
N$33
  Top 0.254: IC6.5 31.11,29.84 31.43,29.53 31.43,24.77 28.89,22.23 28.89,15.56 32.38,12.06 R47.1
N$34
  Top 0.254: R45.2 35.56,17.78 36.83,16.51 40.96,16.51 42.19,17.74 J8.TIP
N$35
  Top 0.254: R44.2 33.97,17.78 35.88,15.88 53.02,15.88 54.26,17.11 J9.TIP
N$36
  Top 0.254: R43.2 32.38,17.78 34.92,15.24 64.45,15.24 66.32,17.11 J10.TIP
N$39
  Top 0.406: IC1.18 44.44,78.01 C6.1 46.19,77.69 L1.2
N$82
  Top 0.254: C7.2 26.67,70.48 28.51,72.33 Q1.1 29.84,72.64 29.84,75.56 31.49,77.21 IC1.8
N$83
  Top 0.254: C2.2 27.94,83.82 29.53,82.23 Q1.2 29.84,81.66 29.84,78.74 30.57,78.01 IC1.7
RANDOM_GATE
  Top 0.254: IC6.7 28.57,27.3 28.26,26.99 28.26,15.24 31.43,12.06 31.43,6.99 33.97,4.45 JP1.3
REF_-5  (via drill 0.6)
  Top 0.305: R29.1 v61.28,55.24 R24.1 | R27.1 v38.42,55.24 R22.1 | R23.1 v49.53,55.24 R28.1 | 64.62,65.41 64.62,63.25 C8.1 64.56,62.76 65.09,62.23 65.41,62.23 v66.04,61.59 | 64.62,65.41 IC2.2 | 66.61,65.58 66.44,65.41 64.62,65.41
  Top 0.406: 66.61,65.58 R8.2
  Bottom 0.305: v38.42,55.24 v49.53,55.24 v61.28,55.24 62.87,55.24 66.04,58.42 v66.04,61.59
RESET  (via drill 0.6)
  Top 0.254: R3.1 38.34,86.7 38.35,86.68 | 38.35,86.68 39.37,86.68 40.32,87.63 46.99,87.63 52.07,82.55 52.07,72.07 v52.7,71.44 | 38.35,86.68 38.34,86.66 IC1.29
  Bottom 0.254: J15.5 v52.7,71.44
RND_CV
  Top 0.254: R33.2 C16.2 42.12,47.41 41.91,47.62 41.91,49.85 42.23,50.16 43.18,50.16 43.81,50.8 IC4.1 43.81,54.61 42.86,55.56 42.86,57.15 40.64,59.37 40.64,62.87 43.18,65.41 47.62,65.41 49.53,67.31 49.53,81.28 45.72,85.09 41.59,85.09 41.53,85.03 IC1.25
SCK  (via drill 0.6)
  Top 0.254: IC1.17 43.03,73.18 44.13,72.07 J15.3 44.13,70.8 45.4,69.53 45.4,68.26 44.77,67.63 33.97,67.63 28.26,61.91 28.26,58.1 31.43,54.93 31.43,51.44 30.16,50.16 30.16,45.72 31.11,44.77 35.56,44.77 v35.88,45.09 | IC6.11 v38.1,28.57
  Bottom 0.254: v35.88,45.09 35.88,44.77 36.51,44.13 36.51,41.59 35.88,40.96 35.88,30.8 v38.1,28.57
SS  (via drill 0.6)
  Top 0.254: IC1.14 40.01,75.65 40.01,74.93 38.73,73.66 38.1,73.66 26.99,62.55 26.99,57.47 30.16,54.29 30.16,52.07 28.89,50.8 28.89,45.09 30.48,43.5 38.42,43.5 v38.73,43.81 | IC6.12 37.78,29.84 v38.1,30.16
  Bottom 0.254: v38.73,43.81 38.73,43.18 37.78,42.23 37.78,40.96 37.15,40.32 37.15,35.24 39.05,33.34 39.05,31.11 v38.1,30.16
SW_RESET
  Top 0.254: IC1.1 33.71,82.81 33.66,82.87 33.66,84.77 32.07,86.36 19.68,86.36 18.73,85.41 18.73,75.88 19.68,74.93 SW1.P2 SW1.P5
TEMPO  (via drill 0.6)
  Top 0.254: R1.P$2 22.86,90.81 25.4,93.34 40.32,93.34 v40.64,93.66 | v40.64,82.55 40.64,80.33 42.16,78.81 IC1.19
  Bottom 0.254: v40.64,93.66 v40.64,82.55
VCC
  Top 0.406: IC7.3 65.41,87.06 65.41,88.9 66.53,90.03 C19.+ 67.45,90.17 D1.C
VEE
  Top 0.406: R8.1 69.85,65.41 72.39,67.94 J16.10 J16.9
X_CV
  Top 0.254: IC1.23 46.9,82.01 48.26,80.64 48.26,67.94 47.31,66.99 34.29,66.99 28.89,61.59 28.89,58.42 32.7,54.61 IC3.1 32.7,50.8 32.07,50.16 31.11,50.16 30.8,49.85 30.8,47.62 31.01,47.41 C15.2 R30.2
Y_CV
  Top 0.254: IC1.24 47.05,82.81 48.9,80.96 48.9,67.63 47.31,66.04 36.83,66.04 33.66,62.87 C10.2 | C10.2 R13.2 | IC3.7 33.97,58.42 33.34,59.05 33.02,59.05 32.7,59.37 32.7,61.59 32.92,61.81 C10.2

### Text on the board
bPlace: Red stripe
tNames: Grids | cc-by-sa Émilie Gillet | 2014, v0.2
bNames: Grids | cc-by-sa Émilie Gillet | +5V | GND | <RX | 2014, v0.2 | +12V | OMG MIDI! | GND | GND | GND | -12V | ISP | GND | >RANDOM GATE | BONUS BAIT!